# EAGLE design QTPyNoisyBoi (EAGLE 9.6.2)
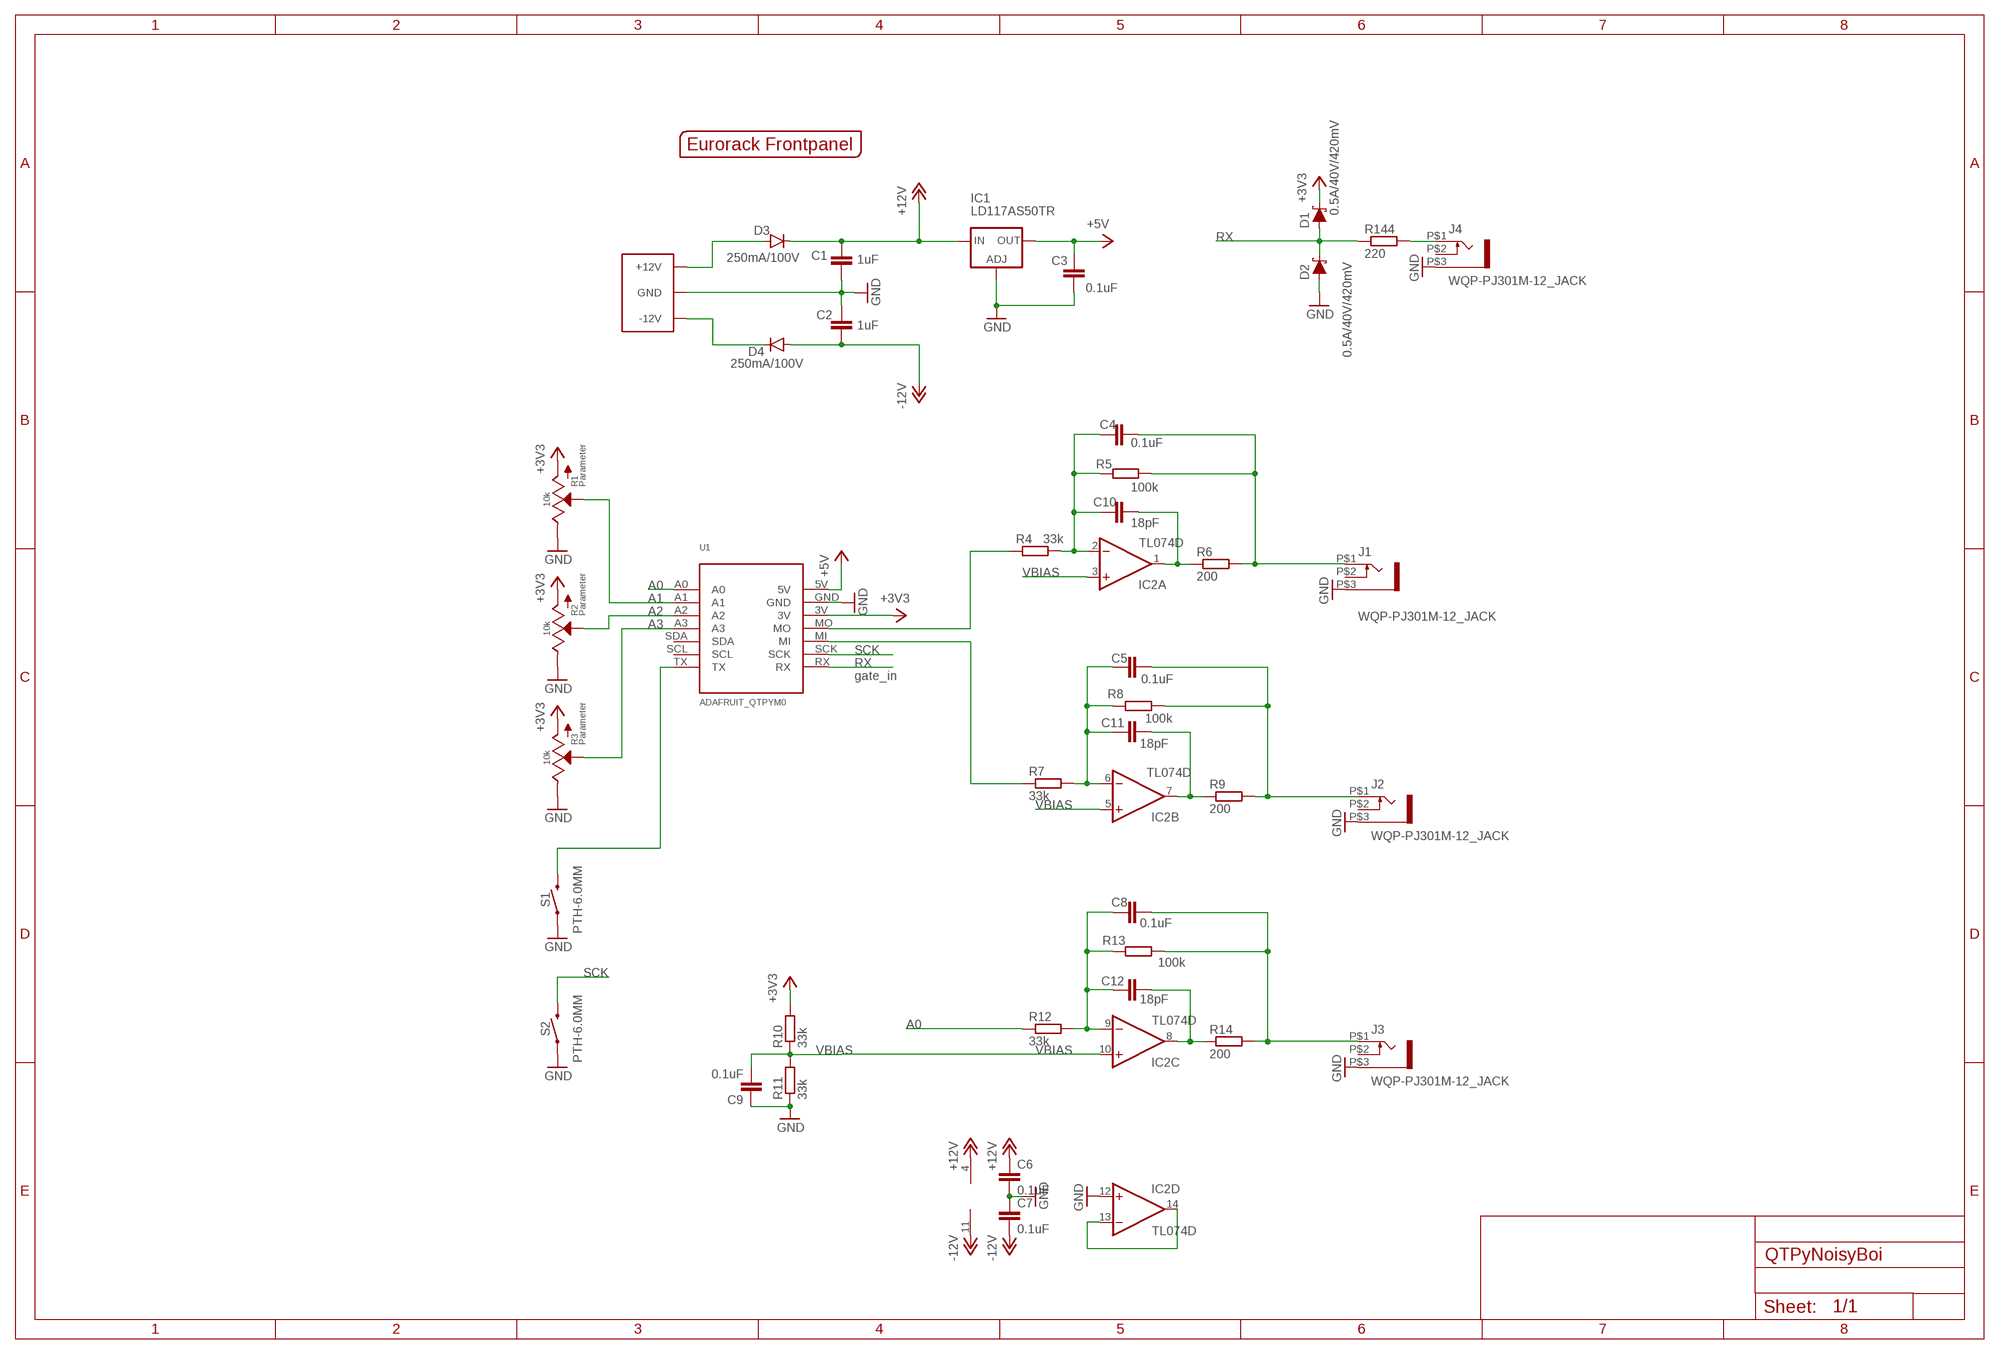
[diagram p0: schematic, sheet 1]

## Parts
C1  1uF  C-EUC0805  [C0805]
C2  1uF  C-EUC0805  [C0805]
C3  0.1uF  C-EUC0805  [C0805]
C4  0.1uF  C-EUC0805  [C0805]
C5  0.1uF  C-EUC0805  [C0805]
C6  0.1uF  C-EUC0805  [C0805]
C7  0.1uF  C-EUC0805  [C0805]
C8  0.1uF  C-EUC0805  [C0805]
C9  0.1uF  C-EUC0805  [C0805]
C10  18pF  C-EUC0805  [C0805]
C11  18pF  C-EUC0805  [C0805]
C12  18pF  C-EUC0805  [C0805]
D1  0.5A/40V/420mV  DIODE-SCHOTTKY-PMEG4005EJ  [SOD-323]
D2  0.5A/40V/420mV  DIODE-SCHOTTKY-PMEG4005EJ  [SOD-323]
D3  250mA/100V  DIODEBAS16  [SOD-323]
D4  250mA/100V  DIODEBAS16  [SOD-323]
DIM1  EURO_POWER_LOCKSKINNY  [EURO_POWER_HEADER]
IC1  LD117AS50TR  [SOT223]
IC2  TL074D  [SO14]
J1  WQP-PJ301M-12_JACK  [WQP-PJ301M-12_JACK]
J2  WQP-PJ301M-12_JACK  [WQP-PJ301M-12_JACK]
J3  WQP-PJ301M-12_JACK  [WQP-PJ301M-12_JACK]
J4  WQP-PJ301M-12_JACK  [WQP-PJ301M-12_JACK]
R1  10k  POTZEPHPOT  [OG-POTS_ALPS_POT_VERTICAL]
R2  10k  POTZEPHPOT  [OG-POTS_ALPS_POT_VERTICAL]
R3  10k  POTZEPHPOT  [OG-POTS_ALPS_POT_VERTICAL]
R4  33k  R-EU_R0805  [R0805]
R5  100k  R-EU_R0805  [R0805]
R6  200  R-EU_R0805  [R0805]
R7  33k  R-EU_R0805  [R0805]
R8  100k  R-EU_R0805  [R0805]
R9  200  R-EU_R0805  [R0805]
R10  33k  R-EU_R0805  [R0805]
R11  33k  R-EU_R0805  [R0805]
R12  33k  R-EU_R0805  [R0805]
R13  100k  R-EU_R0805  [R0805]
R14  200  R-EU_R0805  [R0805]
R144  220  R-EU_R0805  [R0805]
S1  PTH-6.0MM  MOMENTARY-SWITCH-SPST-PTH-6.0MM  [TACTILE_SWITCH_PTH_6.0MM]
S2  PTH-6.0MM  MOMENTARY-SWITCH-SPST-PTH-6.0MM  [TACTILE_SWITCH_PTH_6.0MM]
U1  ADAFRUIT_QTPYM0  [ADAFRUIT_QTPY_M0]
U$1  EURORACK_PANEL6HP  [EURORACK6HPPANEL]

## Nets
+3V3: D1.C R1.P$3(A) R2.P$3(A) R3.P$3(A) R10.2 U1.3V
+5V: C3.2 IC1.4(OUT) U1.5V
+12V: C1.2 C6.1 D3.C IC1.3(IN) IC2.4(P:V+)
-12V: C2.1 C7.2 D4.A IC2.11(P:V-)
A0: R12.1 U1.A0
A1: R1.P$2(S) U1.A1
A2: R2.P$2(S) U1.A2
A3: R3.P$2(S) U1.A3
GND: C1.1 C2.2 C3.1 C6.2 C7.1 C9.1 D2.A DIM1.3(GND) DIM1.4(GND) DIM1.5(GND) DIM1.6(GND) DIM1.7(GND) DIM1.8(GND) IC1.1(ADJ) IC2.12(D:+IN) J1.P$3 J2.P$3 J3.P$3 J4.P$3 R1.P$1(E) R2.P$1(E) R3.P$1(E) R11.1 S1.1 S2.1 U1.GND
N$1: C5.2 J2.P$1 R8.2 R9.2
N$2: S1.3 U1.TX
N$3: C12.2 IC2.8(C:OUT) R14.1
N$4: C8.1 C12.1 IC2.9(C:-IN) R12.2 R13.1
N$5: J4.P$1 R144.2
N$6: R4.1 U1.MO
N$7: R7.1 U1.MI
N$8: IC2.13(D:-IN) IC2.14(D:OUT)
N$9: C4.2 J1.P$1 R5.2 R6.2
N$10: C4.1 C10.1 IC2.2(A:-IN) R4.2 R5.1
N$11: C8.2 J3.P$1 R13.2 R14.2
N$12: D4.C DIM1.1(-12V) DIM1.2(-12V)
N$13: C5.1 C11.1 IC2.6(B:-IN) R7.2 R8.1
N$14: C11.2 IC2.7(B:OUT) R9.1
N$17: D3.A DIM1.9(+12V) DIM1.10(+12V)
N$18: C10.2 IC2.1(A:OUT) R6.1
RX: D1.A D2.C R144.1 U1.RX
SCK: S2.3 U1.SCK
VBIAS: C9.2 IC2.3(A:+IN) IC2.5(B:+IN) IC2.10(C:+IN) R10.1 R11.2
Unconnected: J1.P$2 J2.P$2 J3.P$2 J4.P$2 U1.SCL U1.SDA

## Notes on the sheet
- gate_in

## Library data of the parts
C1-C12 = rcl:C-EU: CAPACITOR, European symbol; SPICEPREFIX: C
D1 D2 = SparkFun-DiscreteSemi:DIODE-SCHOTTKY: Schottky diode A Schottky diode is a semiconductor diode which has a low forward voltage drop and a very fast switching action.; PROD_ID: DIO-10955
D3 D4 = halcyonmod_DiscreteSemi:DIODE: Diode These are standard reverse protection diodes and small signal diodes. SMA package can handle up to about 1A. SOD-323 can handle about 200mA. What the SOD-323 package when ordering, there are some mfgs out there that are 5-pin packages.; PROD_ID: DIO-09646
DIM1 = MusicThingModular:EURO_POWER_LOCK
IC1 = v-reg:LD117A?*: Low drop fixed and adjustable positive voltage regulators 1 A Source: http://www.st.com/stonline/products/literature/ds/7194/ld1117axx.pdf
IC2 = linear:TL074: OP AMP
J1-J4 = thonkiconn:WQP-PJ301M-12_JACK
R1-R3 = EurorackModularParts:POT; DESC: Parameter
R4-R14 R144 = rcl:R-EU_: RESISTOR, European symbol; SPICEPREFIX: R
S1 S2 = SparkFun-Switches:MOMENTARY-SWITCH-SPST: Momentary Switch (Pushbutton) - SPST Normally-open (NO) SPST momentary switches (buttons, pushbuttons). Variants PTH-12MM - 12mm square, through-hole Momentary Pushbutton Switch - 12mm Square <https://www.sparkfun.com/products/9190> (COM-09190) PTH-6.0MM, PTH-6.0MM-KIT - 6.0mm square, through-hole Mini Pushbutton Switch <https://www.sparkfun.com/products/97> (COM-00097) KIT package intended for soldering kit's - only one side of pads' copper is exposed. PTH-RIGHT-ANGLE-KIT - Right-angle, through-hole Right Angle Tactile Button <https://www.sparkfun.com/products/10791> - Used on SparkFun BigTime Watch Kit <https://www.sparkfun.com/products/11734> SMD-12MM - 12mm square, surface-mount Tactile Button - SMD (12mm) <https://www.sparkfun.com/products/12993> (COM-12993) Used on SparkFun PicoBoard <https://www.sparkfun.com/products/11888> SMD-4.5MM - 4.5mm Square Trackball Switch Used on SparkFun Blackberry Trackballer Breakout <https://www.sparkfun.com/products/13169> SMD-4.6MMX2.8MM - 4.60mm x 2.80mm, surface mount Used on SparkFun SAMD21 Mini Breakout <https://www.sparkfun.com/products/13664> SMD-5.2MM, SMD-5.2-REDUNDANT - 5.2mm square, surface-mount Mini Pushbutton Switch - SMD <https://www.sparkfun.com/products/8720> (COM-08720) Used on Arduino Pro Mini <https://www.sparkfun.com/products/11114> REDUNDANT package connects both switch circuits together SMD-6.0X3.5MM - 6.0 x 3.5mm, surface mount Momentary Reset Switch SMD <https://www.sparkfun.com/products/8229> (COM-08229) SMD-6.2MM-TALL - 6.2mm square, surface mount Tactile Button - SMD (6mm) <https://www.sparkfun.com/products/12992> Used on SparkFun Digital Sandbox <https://www.sparkfun.com/products/12651> SMD-RIGHT-ANGLE - Right-angle, surface mount Used on SparkFun Block for Intel® Edison - Arduino <https://www.sparkfun.com/products/13036>; PROD_ID: SWCH-08441; SF_SKU: COM-00097
U1 = todstuff:ADAFRUIT_QTPY
U$1 = EurorackModularParts:EURORACK_PANEL

## Board
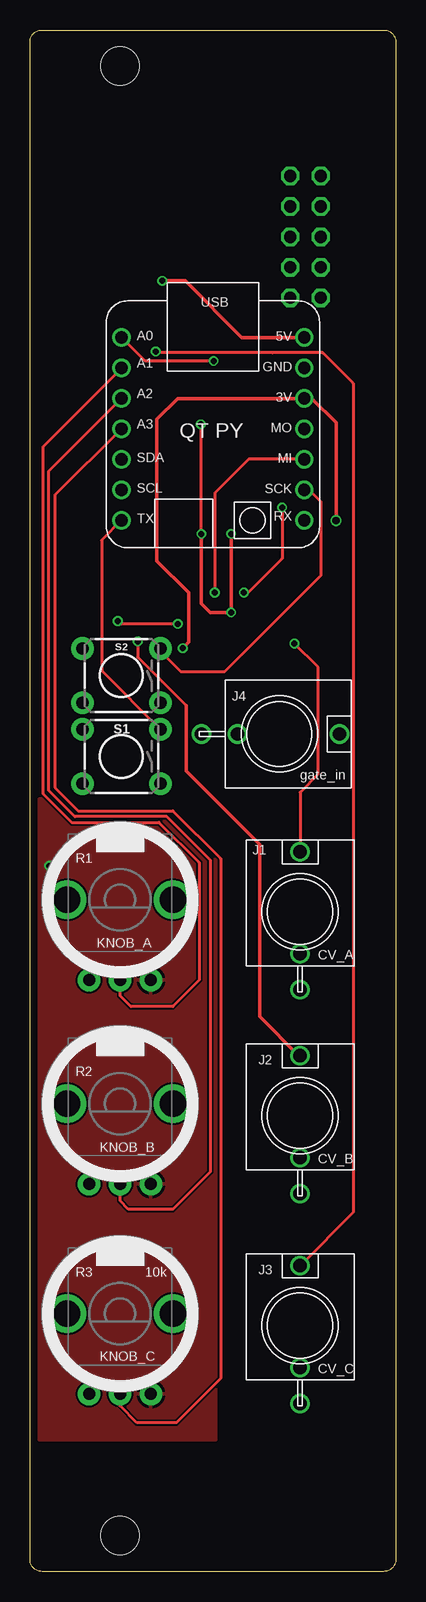
[diagram p1: board, top side]
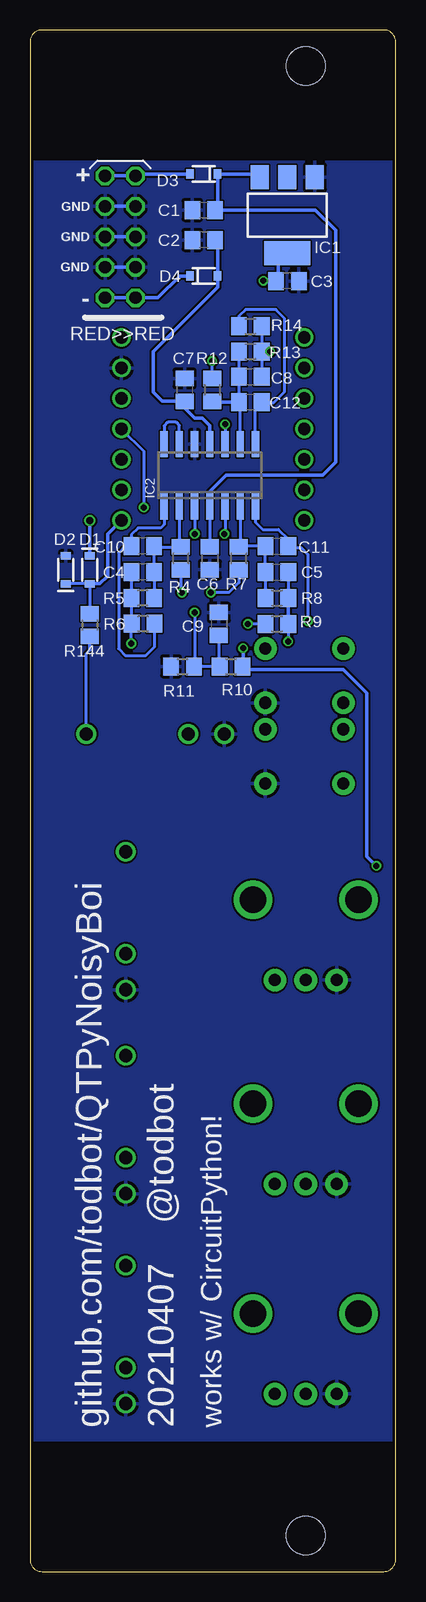
[diagram p2: board, bottom side, seen from below]

Size 30.48 x 128.5 mm. Coordinates in mm from the lower left corner, seen from the top.
Copper layers (1*16): Top 0.035mm / dielectric 0.785mm / Bottom 0.035mm
Design rules "SeeedStudio_2layer_DRU_no_angle_20140221_blink1thin": minimum track width 6mil, minimum drill 12mil, track to track 6mil, track to pad 6mil, pad to pad 6mil, via to via 6mil, smd to smd 0mil, copper to edge 10mil, drill to drill 10mil, minimum pad ring 10mil, minimum via ring 6mil, stop-mask expansion 2mil, vias tented up to drill 100mil, thermal gap 10mil

### Footprints (pad centres in the part's own frame; a part is rotated, then mirrored left to right if it is on the bottom)
C0805 = smd 1.3 x 1.5: 1 -0.95,0; 2 0.95,0
SOD-323 = smd 0.63 x 0.83: A 1.15,0; C -1.15,0
EURO_POWER_HEADER = drill 1.016 octagon: 1 -5.08,-1.27; 2 -5.08,1.27; 3 -2.54,-1.27; 4 -2.54,1.27; 5 0,-1.27; 6 0,1.27; 7 2.54,-1.27; 8 2.54,1.27; 9 5.08,-1.27; 10 5.08,1.27
SOT223 = smd 1.5 x 2: 1 -2.3,-3.15; 2 0,-3.15; 3 2.3,-3.15 | smd 3.8 x 2: 4 0,3.15
SO14 = smd 0.6 x 2.2: 1 -3.81,-2.6; 2 -2.54,-2.6; 3 -1.27,-2.6; 4 0,-2.6; 5 1.27,-2.6; 6 2.54,-2.6; 7 3.81,-2.6; 8 3.81,2.6; 9 2.54,2.6; 10 1.27,2.6; 11 0,2.6; 12 -1.27,2.6; 13 -2.54,2.6; 14 -3.81,2.6
WQP-PJ301M-12_JACK = drill 1.1: P$1 0,5; P$2 0,-3.5; P$3 0,-6.5
OG-POTS_ALPS_POT_VERTICAL = drill 1 pad 1.88: P$1 -2.58,-6.7; P$2 0,-6.7; P$3 2.58,-6.7 | drill 2.2 pad 3.175: P$4 4.4,0; P$5 -4.4,0
R0805 = smd 1.3 x 1.5: 1 -0.95,0; 2 0.95,0
TACTILE_SWITCH_PTH_6.0MM = drill 1.016 pad 1.88: 1 -3.251,2.261; 2 3.251,2.261; 3 -3.251,-2.261; 4 3.251,-2.261
ADAFRUIT_QTPY_M0 = drill 1.016: 3V 7.62,2.54; 5V 7.62,7.62; A0 -7.62,7.62; A1 -7.62,5.08; A2 -7.62,2.54; A3 -7.62,0; GND 7.62,5.08; MI 7.62,-2.54; MO 7.62,0; RX 7.62,-7.62; SCK 7.62,-5.08; SCL -7.62,-5.08; SDA -7.62,-2.54; TX -7.62,-7.62
EURORACK6HPPANEL = hole 3.2: 7.5,3; 7.5,125.5

### Placement (x,y rotation side)
C1  16,113.5 0 bottom
C2  16,111 180 bottom
C3  9.03,107.58 180 bottom
C4  21.08,83.31 180 bottom
C5  9.91,83.31 0 bottom
C6  15.49,84.45 270 bottom
C7  17.6,98.51 270 bottom
C8  12.12,99.6 0 bottom
C9  14.73,78.99 270 bottom
C10  21.08,85.47 180 bottom
C11  9.91,85.47 0 bottom
C12  12.12,97.5 0 bottom
D1  25.5,83.5 270 bottom
D2  27.5,83.5 90 bottom
D3  16,116.5 180 bottom
D4  16,108 0 bottom
DIM1  22.96,111.26 90 bottom
IC1  9.04,113.06 180 bottom
IC2  15.5,91.38 0 bottom
J1  22.5,55 0 top
J2  22.5,38 0 top
J3  22.5,20.5 0 top
J4  20.79,69.82 270 top
R1  7.5,56 0 top
R2  7.5,39 0 top
R3  7.5,21.5 0 top
R4  17.91,84.45 90 bottom
R5  21.08,81.15 180 bottom
R6  21.05,79.01 180 bottom
R7  13.08,84.45 90 bottom
R8  9.91,81.15 0 bottom
R9  9.91,78.99 0 bottom
R10  13.72,75.44 0 bottom
R11  17.78,75.44 0 bottom
R12  15.3,98.51 270 bottom
R13  12.12,101.7 0 bottom
R14  12.12,103.8 0 bottom
R144  25.5,78.9 270 bottom
S1  7.62,67.94 180 top
S2  7.62,74.68 180 top
U1  15.24,95.25 0 top
U$1  0,0 0 top

### Tracks (layer width: path | path; a pad name or v marks a point on that pad's centre or on a via)
+3V3  (via drill 0.5, 0.6)
  Top 0.305: v25.5,87.6 25.5,95.78 23.5,97.79 U1.3V 12.33,97.79 10.58,96.04 10.58,84.25 13.23,81.6 13.23,77.48 v12.73,76.97
  Bottom 0.305: v1.61,58.82 2.41,59.62 2.41,73.22 4.38,75.18 12.51,75.18 R10.2 12.73,75.48 v12.73,76.97 | D1.C v25.5,87.6
  pour Top: 0.76,64.38 15.49,64.38 15.49,10.97 0.76,10.97
+5V  (via drill 0.5)
  Top 0.305: v11.03,107.58 12.95,107.58 17.66,102.87 U1.5V
  Bottom 0.254: v11.03,107.58 v11.02,107.58 C3.2
  Bottom 0.305: C3.2 9.8,107.58 9.8,109.15 IC1.4
+12V
  Bottom 0.254: IC2.4 C6.1
  Bottom 0.305: IC2.4 15.5,90.01 14.11,91.4 6.1,91.4 5,92.5 5,111.8 6.7,113.5 C1.2 14.85,113.8 D3.C 11.63,116.5 IC1.3
-12V
  Bottom 0.305: C2.1 15,111 14.85,110.85 D4.A 14.85,107.05 20.2,101.7 20.2,98.31 19.45,97.56 C7.2 17.6,96.97 16.76,96.14 16.13,96.14 15.5,95.51 IC2.11
A0  (via drill 0.5)
  Top 0.254: v15.3,100.91 9.59,100.91 U1.A0
  Top 0.305: U1.A0
  Bottom 0.254: R12.1 v15.3,100.91
A1
  Top 0.254: U1.A1 7.62,100.27 1.08,93.73 1.08,64.84 3.46,62.45 10.75,62.45 14.1,59.1 14.1,49.3 11.9,47.1 8.4,47.1 7.5,48 R1.P$2
A2
  Top 0.254: U1.A2 1.57,91.75 1.57,65.09 3.75,62.92 11.4,62.92 15,59.32 15,33.3 11.9,30.2 8.2,30.2 7.5,30.9 R2.P$2
A3
  Top 0.254: U1.A3 7.58,95.25 2.07,89.74 2.07,65.36 4.02,63.41 11.9,63.41 15.89,59.42 15.89,16.09 12.2,12.4 8.9,12.4 7.5,13.8 R3.P$2
GND
  Bottom 0.305: DIM1.3 DIM1.4 | DIM1.5 DIM1.6 | DIM1.7 DIM1.8
  pour Bottom: -1.27,117.47 31.6,117.47 31.6,10.98 -1.27,10.98
N$1  (via drill 0.5)
  Top 0.254: 13,72.2 8.97,76.23 v8.97,77.54
  Top 0.305: J2.P$1 22.4,43 19.15,46.25 19.15,60.6 13,66.75 13,72.2
  Bottom 0.254: C5.2 R8.2 | R9.2 8.96,77.55
  Bottom 0.305: v8.97,77.54 8.96,77.55 | R9.2 R8.2
N$2
  Top 0.254: U1.TX 5.97,85.98 5.97,75.11 S1.3
N$3
  Bottom 0.254: 11.17,97.4 10.19,97.4 9.3,98.29 9.3,104.5 10,105.2 12.52,105.2 13.07,104.65 R14.1 | IC2.8 11.69,96.98 C12.2
  Bottom 0.305: 11.17,97.4 C12.2
N$4
  Bottom 0.254: R13.1 C8.1 C12.1 12.96,97.39 IC2.9
  Bottom 0.305: C12.1 15.26,97.5 R12.2
N$5
  Bottom 0.254: R144.2 25.5,76.8 25.79,76.51 J4.P$1
N$6  (via drill 0.5)
  Top 0.254: v17.83,81.61 18.17,81.61 21,84.44 v21,88.7
  Bottom 0.254: U1.MO 21,93.39 v21,88.7 | R4.1 17.91,81.69 v17.83,81.61
N$7  (via drill 0.5)
  Top 0.254: U1.MI 18.21,92.71 15.4,89.9 v15.4,81.61
  Bottom 0.254: R7.1 13.08,82.43 13.9,81.61 v15.4,81.61
N$8
  Bottom 0.254: IC2.13 18.04,95.54 18.3,95.8 19,95.8 19.31,95.49 IC2.14
N$9  (via drill 0.5)
  Top 0.254: J1.P$1 22.5,64.95 24.01,66.47 24.01,75.38 v22.04,77.35
  Bottom 0.254: R5.2 C4.2 22.03,79.04 | 22.03,79.04 R6.2 | v22.04,77.35 22.03,77.36 22.03,79.04
N$10
  Bottom 0.254: R5.1 C4.1 C10.1 20.07,85.41 R4.2 18.04,85.54 IC2.2
N$11  (via drill 0.5)
  Top 0.254: J3.P$1 26.92,29.92 26.92,99.06 24.38,101.6 20.19,101.6 10.57,101.6 v10.47,101.7
  Bottom 0.254: R14.2 R13.2 C8.2
  Bottom 0.305: R13.2 v10.47,101.7
N$12
  Bottom 0.305: DIM1.2 DIM1.1 19.82,106.18 18,108 D4.C
N$13
  Bottom 0.254: R8.1 C5.1 C11.1 13.02,85.47 R7.2 12.96,85.53 IC2.6
N$14  (via drill 0.5)
  Top 0.254: v12.32,78.99 7.56,78.99 v7.32,79.23
  Bottom 0.254: IC2.7 11.69,87.47 11.09,86.87 9.78,86.87 8.96,86.05 C11.2 8.83,85.34 7.87,85.34 7.32,84.79 v7.32,79.23 | R9.1 v12.32,78.99
N$17
  Bottom 0.305: DIM1.10 DIM1.9 21.53,116.5 D3.A
N$18
  Bottom 0.254: IC2.1 19.31,87.27 19.59,87 21.46,87 22.03,86.43 C10.2 22.54,85.47 23.1,84.91 23.1,76.92 22.55,76.37 20.83,76.37 20.1,77.1 R6.1
RX
  Bottom 0.254: D2.C D1.A R144.1
  Bottom 0.305: U1.RX 24,86.49 24,83 24.65,82.35 D1.A
SCK
  Top 0.254: S2.3 10.87,76.72 12.57,75.02 16.22,75.02 24.26,83.06 24.26,89.15 23.24,90.17 U1.SCK
VBIAS  (via drill 0.5)
  Top 0.254: v14.22,95.63 14.28,95.58 v14.28,86.5
  Top 0.305: v16.75,86.5 v16.75,79.95 v16.76,79.95 15.04,79.95 14.28,80.71 v14.28,86.5
  Bottom 0.254: v14.22,95.63 IC2.10 | IC2.5 14.23,86.55 v14.28,86.5 | IC2.3 16.77,86.52 v16.75,86.5 | v16.76,79.95 v16.76,79.94 16.76,75.5 R11.2 R10.1 14.73,75.5 C9.2

### Text on the board
tPlace: gate_in | KNOB_A | CV_A | KNOB_B | CV_B | KNOB_C | CV_C
bPlace: @todbot | works w/ CircuitPython! | 20210407 | github.com/todbot/QTPyNoisyBoi